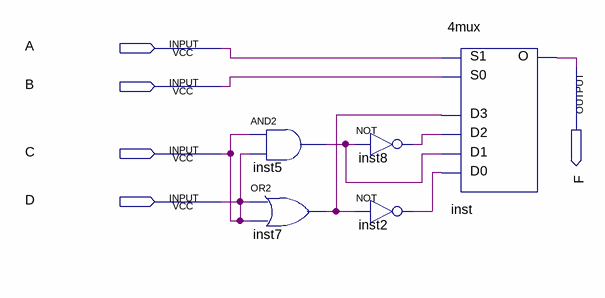
[diagram p0: schematic sheet]
// Quartus schematic hw6p4b.bdf as structural Verilog: 5 symbols, 5 pins
module hw6p4b (
  input  A,
  input  B,
  input  C,
  input  D,
  output F
);

  wire inst2_out, inst5_out, inst7_out, inst8_out;

  and inst5 (inst5_out, C, C);
  or inst7 (inst7_out, C, C);
  not inst8 (inst8_out, inst5_out);
  not inst2 (inst2_out, inst7_out);
  \4mux  inst (.S1(A), .S0(B), .D3(inst7_out), .D2(inst8_out), .D1(inst5_out), .D0(inst2_out), .O(F));

  assign D = C;
endmodule
